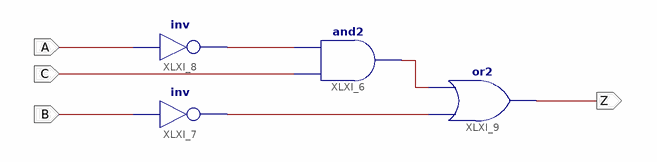
[diagram p0: schematic sheet 1]
// Xilinx ISE schematic p1ej3a.sch (spartan3) as structural Verilog: 4 symbols, 4 ports
module p1ej3a (
  input  A,
  input  C,
  input  B,
  output Z
);

  wire XLXN_10, XLXN_13, XLXN_14;

  and XLXI_6 (XLXN_14, C, XLXN_10);
  not XLXI_7 (XLXN_13, B);
  not XLXI_8 (XLXN_10, A);
  or XLXI_9 (Z, XLXN_13, XLXN_14);
endmodule
